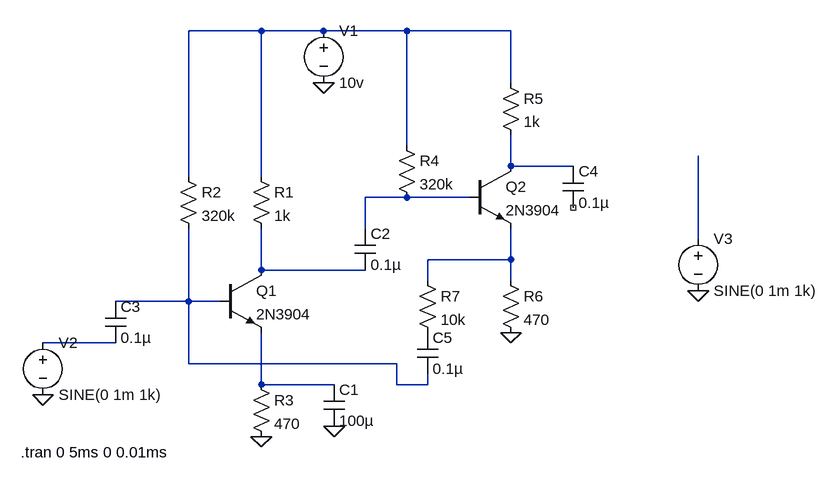
[diagram p0: schematic Az3.asc]
Az3.asc, the LTspice schematic file:
Version 4
SHEET 1 968 680
WIRE 96 -192 -16 -192
WIRE 192 -192 96 -192
WIRE 320 -192 192 -192
WIRE 480 -192 320 -192
WIRE 480 -112 480 -192
WIRE 320 -16 320 -192
WIRE 480 16 480 -32
WIRE 576 16 480 16
WIRE -16 32 -16 -192
WIRE 96 32 96 -192
WIRE 320 64 256 64
WIRE 416 64 320 64
WIRE 256 112 256 64
WIRE 768 128 768 0
WIRE 480 160 480 112
WIRE 480 160 352 160
WIRE 96 176 96 112
WIRE 256 176 96 176
WIRE 352 192 352 160
WIRE 480 192 480 160
WIRE -16 224 -16 112
WIRE -16 224 -128 224
WIRE 32 224 -16 224
WIRE -128 288 -240 288
WIRE -16 320 -16 224
WIRE 304 320 -16 320
WIRE 96 352 96 272
WIRE 208 352 96 352
WIRE 304 352 304 320
WIRE 352 352 352 336
WIRE 352 352 304 352
FLAG 480 272 0
FLAG 96 432 0
FLAG -240 368 0
FLAG 192 -112 0
FLAG 768 208 0
FLAG 208 416 0
SYMBOL npn 32 176 R0
SYMATTR InstName Q1
SYMATTR Value 2N3904
SYMBOL npn 416 16 R0
SYMATTR InstName Q2
SYMATTR Value 2N3904
SYMBOL res 80 16 R0
SYMATTR InstName R1
SYMATTR Value 1k
SYMBOL res -32 16 R0
SYMATTR InstName R2
SYMATTR Value 320k
SYMBOL res 80 336 R0
SYMATTR InstName R3
SYMATTR Value 470
SYMBOL res 304 -32 R0
SYMATTR InstName R4
SYMATTR Value 320k
SYMBOL res 464 -128 R0
SYMATTR InstName R5
SYMATTR Value 1k
SYMBOL res 464 176 R0
SYMATTR InstName R6
SYMATTR Value 470
SYMBOL cap 240 112 R0
SYMATTR InstName C2
SYMATTR Value 0.1µ
SYMBOL cap -144 224 R0
SYMATTR InstName C3
SYMATTR Value 0.1µ
SYMBOL voltage 192 -208 R0
SYMATTR InstName V1
SYMATTR Value 10v
SYMBOL voltage -240 272 R0
WINDOW 123 0 0 Left 0
WINDOW 39 0 0 Left 0
SYMATTR InstName V2
SYMATTR Value SINE(0 1m 1k)
SYMBOL voltage 768 112 R0
WINDOW 123 0 0 Left 0
WINDOW 39 0 0 Left 0
SYMATTR InstName V3
SYMATTR Value SINE(0 1m 1k)
SYMBOL cap 560 16 R0
SYMATTR InstName C4
SYMATTR Value 0.1µ
SYMBOL cap 192 352 R0
SYMATTR InstName C1
SYMATTR Value 100µ
SYMBOL cap 336 272 R0
SYMATTR InstName C5
SYMATTR Value 0.1µ
SYMBOL res 336 176 R0
SYMATTR InstName R7
SYMATTR Value 10k
TEXT -274 456 Left 2 !.tran 0 5ms 0 0.01ms

The netlist it stands for:
* Az3.asc
Q1 N006 N007 N009 0 2N3904
Q2 N002 N003 N005 0 2N3904
R1 N001 N006 1k
R2 N001 N007 320k
R3 N009 0 470
R4 N001 N003 320k
R5 N001 N002 1k
R6 N005 0 470
C2 N003 N006 0.1µ
C3 N007 N008 0.1µ
V1 N001 0 10v
V2 N008 0 SINE(0 1m 1k)
V3 N004 0 SINE(0 1m 1k)
C4 N002 NC_01 0.1µ
C1 N009 0 100µ
C5 P001 N007 0.1µ
R7 N005 P001 10k
.model NPN NPN
.model PNP PNP
.lib standard.bjt
.tran 0 5ms 0 0.01ms
.backanno
.end